# EAGLE design smart_tft (EAGLE 6.2)
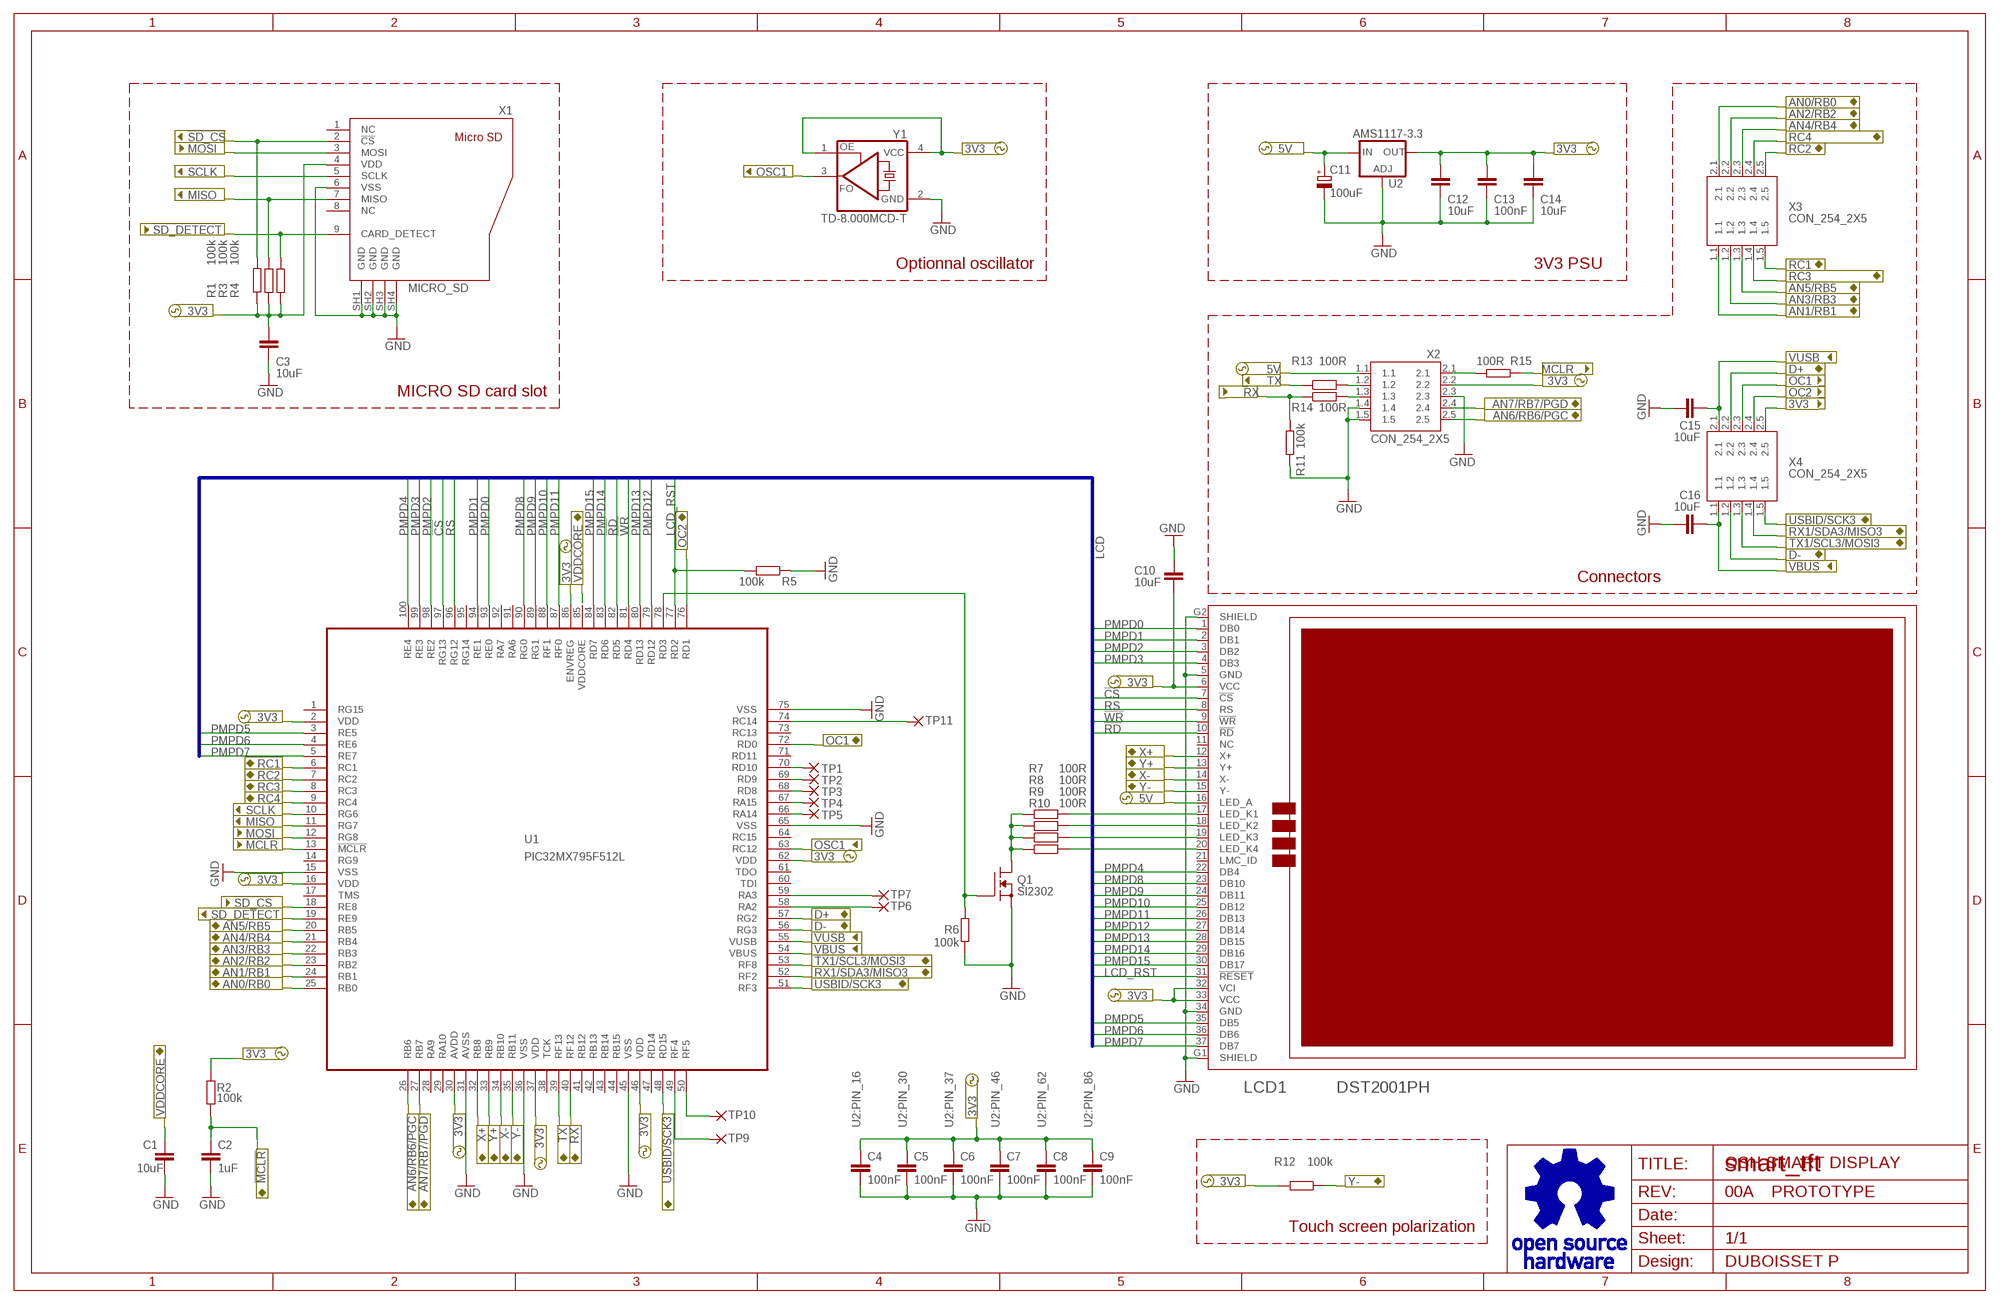
[diagram p0: schematic, sheet 1]

## Parts
C1  10uF  C-EUC0805  [C0805]
C2  1uF  C-EUC0603  [C0603]
C3  10uF  C-EUC0805  [C0805]
C4  100nF  C-EUC0603  [C0603]
C5  100nF  C-EUC0603  [C0603]
C6  100nF  C-EUC0603  [C0603]
C7  100nF  C-EUC0603  [C0603]
C8  100nF  C-EUC0603  [C0603]
C9  100nF  C-EUC0603  [C0603]
C10  10uF  C-EUC0805  [C0805]
C11  100uF  CPOL-EUSMCD  [SMC_D]
C12  10uF  C-EUC0805  [C0805]
C13  100nF  C-EUC0603  [C0603]
C14  10uF  C-EUC0805  [C0805]
C15  10uF  C-EUC0805  [C0805]
C16  10uF  C-EUC0805  [C0805]
LCD1  DST2001PH  [DST2001PH]
Q1  SI2302  [SOT23-BEC]
R1  100k  R-EU_R0603  [R0603]
R2  100k  R-EU_R0603  [R0603]
R3  100k  R-EU_R0603  [R0603]
R4  100k  R-EU_R0603  [R0603]
R5  100k  R-EU_R0603  [R0603]
R6  100k  R-EU_R0603  [R0603]
R7  100R  R-EU_R0603  [R0603]
R8  100R  R-EU_R0603  [R0603]
R9  100R  R-EU_R0603  [R0603]
R10  100R  R-EU_R0603  [R0603]
R11  100k  R-EU_R0603  [R0603]
R12  100k  R-EU_R0603  [R0603]
R13  100R  R-EU_R0603  [R0603]
R14  100R  R-EU_R0603  [R0603]
R15  100R  R-EU_R0603  [R0603]
TP1  1.27R  [1.27R]
TP2  1.27R  [1.27R]
TP3  1.27R  [1.27R]
TP4  1.27R  [1.27R]
TP5  1.27R  [1.27R]
TP6  1.27R  [1.27R]
TP7  1.27R  [1.27R]
TP9  1.27R  [1.27R]
TP10  1.27R  [1.27R]
TP11  1.27R  [1.27R]
U1  PIC32MX795F512L  PIC24FJ256GB110  [TQFP100-14X14]
U2  AMS1117-3.3  LD117AS33TR  [SOT223]
X1  MICRO_SD  [SD_MICRO]
X2  CON_254_2X5  [2X5_CMS]
X3  CON_254_2X5  [2X5_CMS]
X4  CON_254_2X5  [2X5_CMS]
Y1  TD-8.000MCD-T  ASF1  [ASF]

## Nets
3V3: C3.1 C4.1 C5.1 C6.1 C7.1 C8.1 C9.1 C10.2 C12.1 C13.1 C14.1 LCD1.6(VCC) LCD1.32(VCI) LCD1.33(VCC) R1.1 R2.2 R3.2 R4.2 R12.2 U1.2(VDD) U1.16(VDD) U1.30(AVDD) U1.37(VDD) U1.46(VDD) U1.62(VDD) U1.86(ENVREG) U2.4(OUT) X1.4(VDD) X2.2.2 X4.2.5 Y1.1(OE) Y1.4(VCC)
5V: C11.+ LCD1.16(LED_A) U2.3(IN) X2.1.1
!CS: LCD1.7(!CS) U1.97(RG13)
!MCLR: C2.1 R2.1 R15.1 U1.13(!MCLR)
!RD: LCD1.10(!RD) U1.82(RD5)
!SD_CS: R1.2 U1.18(RE8) X1.2(!CS)
!SD_DETECT: R4.1 U1.19(RE9) X1.9(CARD_DETECT)
!WR: LCD1.9(!WR) U1.81(RD4)
AN0/RB0: U1.25(RB0) X3.2.1
AN1/RB1: U1.24(RB1) X3.1.1
AN2/RB2: U1.23(RB2) X3.2.2
AN3/RB3: U1.22(RB3) X3.1.2
AN4/RB4: U1.21(RB4) X3.2.3
AN5/RB5: U1.20(RB5) X3.1.3
AN6/RB6/PGC: U1.26(RB6) X2.2.5
AN7/RB7/PGD: U1.27(RB7) X2.2.4
D+: U1.57(RG2) X4.2.2
D-: U1.56(RG3) X4.1.2
GND: C1.1 C2.2 C3.2 C4.2 C5.2 C6.2 C7.2 C8.2 C9.2 C10.1 C11.- C12.2 C13.2 C14.2 C15.2 C16.2 LCD1.5(GND) LCD1.34(GND) LCD1.G1(SHIELD) LCD1.G2(SHIELD) Q1.E(S) R5.1 R6.1 R11.1 U1.15(VSS) U1.31(AVSS) U1.36(VSS) U1.45(VSS) U1.65(VSS) U1.75(VSS) U2.1(ADJ) X1.6(VSS) X1.SH1(GND) X1.SH2(GND) X1.SH3(GND) X1.SH4(GND) X2.1.4 X2.1.5 X2.2.3 Y1.2(GND)
LCD_RST: LCD1.31(!RESET) R5.2 U1.77(RD2)
MISO: R3.1 U1.11(RG7) X1.7(MISO)
MOSI: U1.12(RG8) X1.3(MOSI)
N$1: TP6.P$1(P) U1.58(RA2)
N$2: Q1.C(D) R7.1 R8.1 R9.1 R10.1
N$3: Q1.B(G) R6.2 U1.78(RD3)
N$4: R13.2 X2.1.2
N$5: R14.2 X2.1.3
N$6: TP7.P$1(P) U1.59(RA3)
N$7: TP5.P$1(P) U1.66(RA14)
N$8: TP4.P$1(P) U1.67(RA15)
N$9: LCD1.20(LED_K4) R10.2
N$10: LCD1.19(LED_K3) R9.2
N$11: LCD1.18(LED_K2) R8.2
N$12: LCD1.17(LED_K1) R7.2
N$13: TP3.P$1(P) U1.68(RD8)
N$14: TP2.P$1(P) U1.69(RD9)
N$15: TP1.P$1(P) U1.70(RD10)
N$17: TP9.P$1(P) U1.49(RF4)
N$18: TP10.P$1(P) U1.50(RF5)
N$19: TP11.P$1(P) U1.74(RC14)
N$65: R15.2 X2.2.1
OC1: U1.72(RD0) X4.2.3
OC2: U1.76(RD1) X4.2.4
OSC1: U1.63(RC12) Y1.3(FO)
PMPD0: LCD1.1(DB0) U1.93(RE0)
PMPD1: LCD1.2(DB1) U1.94(RE1)
PMPD2: LCD1.3(DB2) U1.98(RE2)
PMPD3: LCD1.4(DB3) U1.99(RE3)
PMPD4: LCD1.22(DB4) U1.100(RE4)
PMPD5: LCD1.35(DB5) U1.3(RE5)
PMPD6: LCD1.36(DB6) U1.4(RE6)
PMPD7: LCD1.37(DB7) U1.5(RE7)
PMPD8: LCD1.23(DB10) U1.90(RG0)
PMPD9: LCD1.24(DB11) U1.89(RG1)
PMPD10: LCD1.25(DB12) U1.88(RF1)
PMPD11: LCD1.26(DB13) U1.87(RF0)
PMPD12: LCD1.27(DB14) U1.79(RD12)
PMPD13: LCD1.28(DB15) U1.80(RD13)
PMPD14: LCD1.29(DB16) U1.83(RD6)
PMPD15: LCD1.30(DB17) U1.84(RD7)
RC1: U1.6(RC1) X3.1.5
RC2: U1.7(RC2) X3.2.5
RC3: U1.8(RC3) X3.1.4
RC4: U1.9(RC4) X3.2.4
RS: LCD1.8(RS) U1.96(RG12)
RX: R11.2 R14.1 U1.40(RF12)
RX1/SDA3/MISO3: U1.52(RF2) X4.1.4
SCLK: U1.10(RG6) X1.5(SCLK)
TX: R13.1 U1.39(RF13)
TX1/SCL3/MOSI3: U1.53(RF8) X4.1.3
USBID/SCK3: U1.48(RD15) U1.51(RF3) X4.1.5
VBUS: C16.1 U1.54(VBUS) X4.1.1
VDDCORE: C1.2 U1.85(VDDCORE)
VUSB: C15.1 U1.55(VUSB) X4.2.1
X+: LCD1.12(X+) U1.32(RB8)
X-: LCD1.14(X-) U1.34(RB10)
Y+: LCD1.13(Y+) U1.33(RB9)
Y-: LCD1.15(Y-) R12.1 U1.35(RB11)
Unconnected: LCD1.11(NC) LCD1.21(LMC_ID) U1.1(RG15) U1.14(RG9) U1.17(TMS) U1.28(RA9) U1.29(RA10) U1.38(TCK) U1.41(RB12) U1.42(RB13) U1.43(RB14) U1.44(RB15) U1.47(RD14) U1.60(TDI) U1.61(TDO) U1.64(RC15) U1.71(RD11) U1.73(RC13) U1.91(RA6) U1.92(RA7) U1.95(RG14) X1.1(NC) X1.8(NC)

## Buses
LCD

## Notes on the sheet
- Optionnal oscillator | 3V3 PSU
- MICRO SD card slot
- Connectors
- U2:PIN_16 | U2:PIN_30 | U2:PIN_37 | U2:PIN_46 | U2:PIN_62 | U2:PIN_86
- OSH SMART DISPLAY
- 00A | PROTOTYPE
- Touch screen polarization

## Library data of the parts
C1-C10 C12-C16 = rcl:C-EU: CAPACITOR, European symbol
C11 = rcl:CPOL-EU: POLARIZED CAPACITOR, European symbol
LCD1 = tft:DST2001PH
Q1 = transistor:SI2302
R1-R15 = rcl:R-EU_: RESISTOR, European symbol
TP1-TP7 TP9-TP11 = wirepad:1.27R
U1 = microchip:PIC24FJ256GB110: PIC24FJ256GB110 edit this description Auto generated by make-symbol-device-package-bsdl.ulp Rev. 25 Source: PIC24FJ256GB110.bsd; MPN: PIC24FJ256GB110-I/PF; OC_FARNELL: 1576870; OC_NEWARK: 54M5133
U2 = v-reg:LD117A?*: Low drop fixed and adjustable positive voltage regulators 1 A Source: http://www.st.com/stonline/products/literature/ds/7194/ld1117axx.pdf
X1 = sd-card:MICRO_SD
X2-X4 = con254:CON_254_2X5
Y1 = crystal:ASF*: CRYSTAL CLOCK OSCILLATORS 5.0 Vdc or 3.3 Vdc - LOW PROFILE ULTRA MINIATURE CERAMIC SURFACE MOUNT Source: http://www.abracon.com/Oscillators/asf1-L-L1.pdf; OC_FARNELL: unknown; OC_NEWARK: unknown

## Board
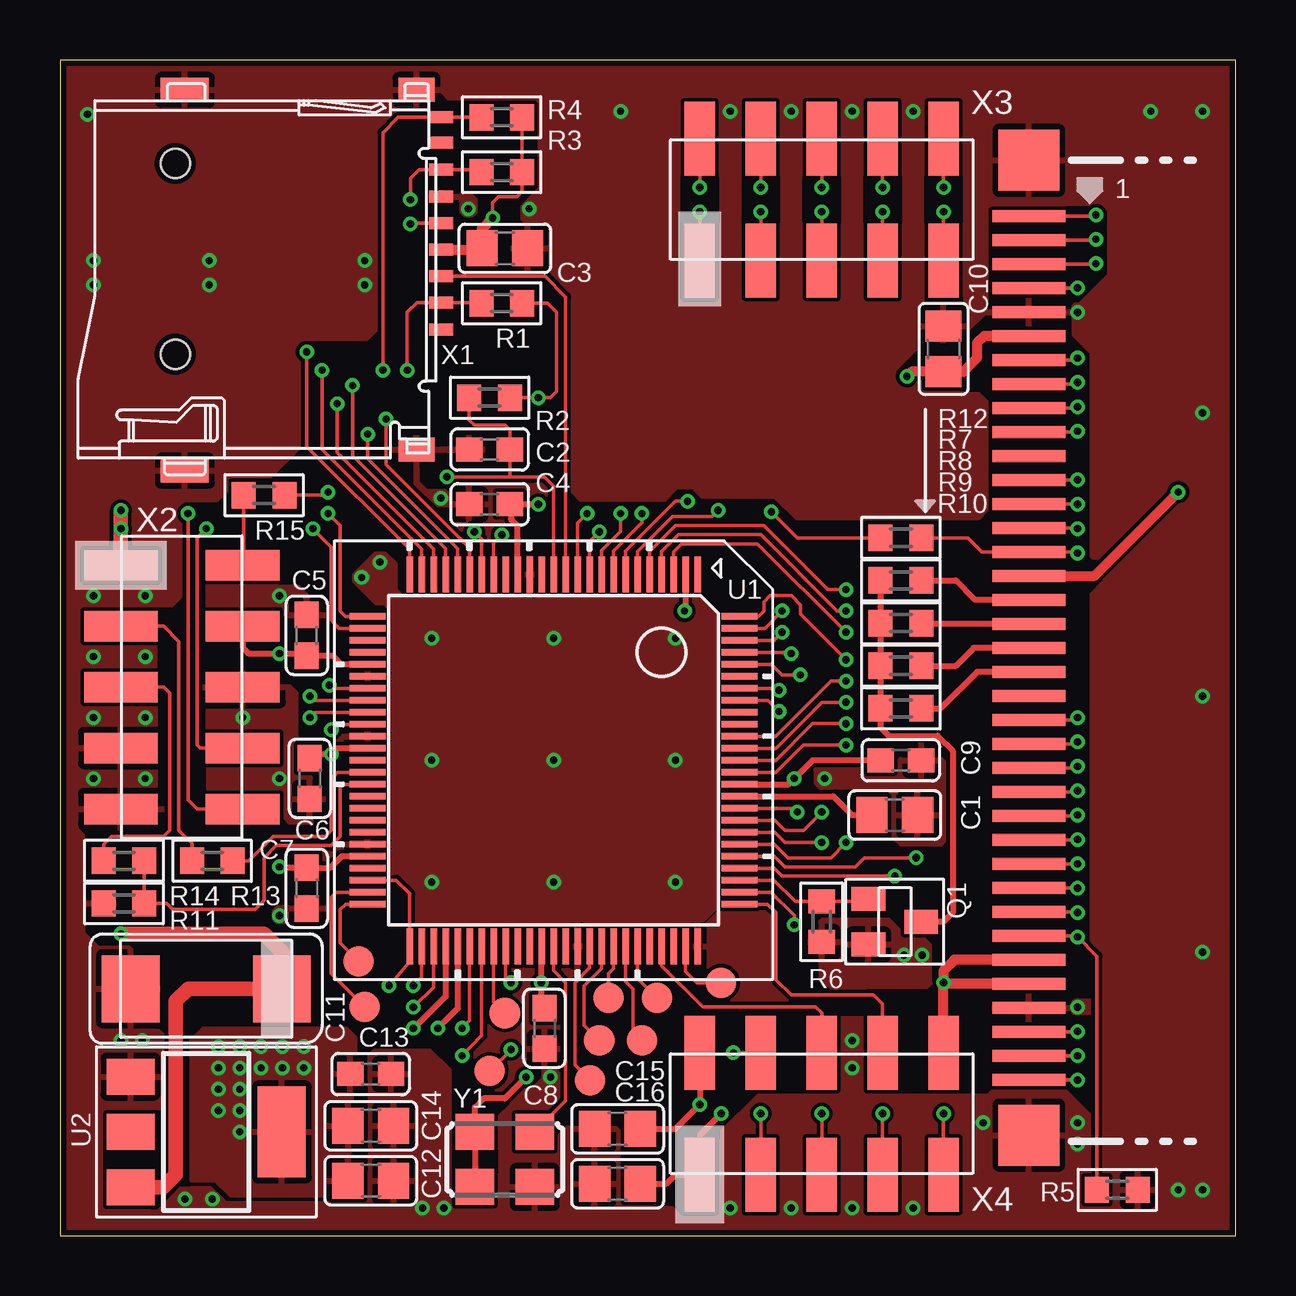
[diagram p1: board, top side]
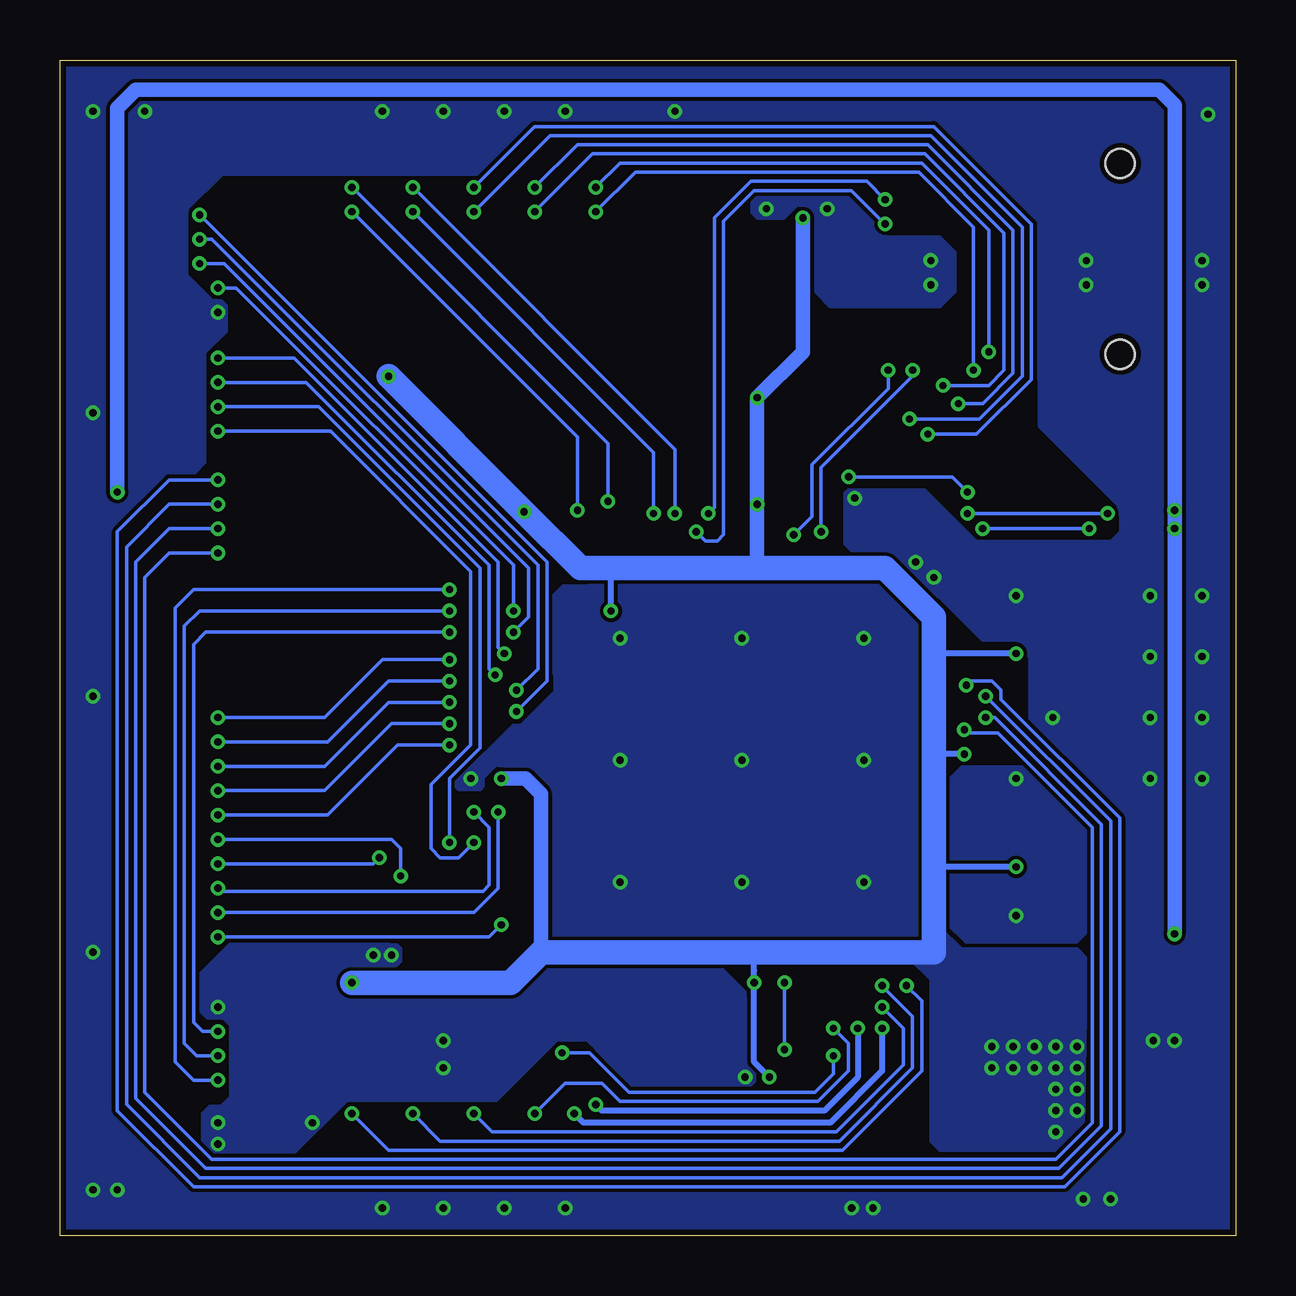
[diagram p2: board, bottom side, seen from below]

Size 49 x 49 mm. Coordinates in mm from the lower left corner, seen from the top.
Outline: 0,0 49,0 49,49 0,49 0,0
Copper layers (1*16): Top 0.035mm / dielectric 1.5mm / Bottom 0.035mm
Design rules: minimum track width 6mil, minimum drill 12mil, track to track 6mil, track to pad 6mil, pad to pad 6mil, via to via 6mil, smd to smd 0mil, copper to edge 10mil, drill to drill 10mil, minimum pad ring 10mil, minimum via ring 6mil, stop-mask expansion 2mil, vias tented up to drill 100mil, thermal gap 10mil
tRestrict: 257 lines
bRestrict: 74 lines

### Footprints (pad centres in the part's own frame; a part is rotated, then mirrored left to right if it is on the bottom)
C0805 = smd 1.3 x 1.5: 1 -0.95,0; 2 0.95,0
C0603 = smd 1.1 x 1: 1 -0.85,0; 2 0.85,0
SMC_D = smd 2.4 x 2.8: + -3.15,0; - 3.15,0
DST2001PH = smd 3.048 x 0.5: 1 0,18; 2 0,17; 3 0,16; 4 0,15; 5 0,14; 6 0,13; 7 0,12; 8 0,11; 9 0,10; 10 0,9; 11 0,8; 12 0,7; 13 0,6; 14 0,5; 15 0,4; 16 0,3; 17 0,2; 18 0,1; 19 0,0; 20 0,-1; 21 0,-2; 22 0,-3; 23 0,-4; 24 0,-5; 25 0,-6; 26 0,-7; 27 0,-8; 28 0,-9; 29 0,-10; 30 0,-11; 31 0,-12; 32 0,-13; 33 0,-14; 34 0,-15; 35 0,-16; 36 0,-17; 37 0,-18 | smd 2.54 x 2.54: G1 0,20.32; G2 0,-20.32
SOT23-BEC = smd 1 x 1.4: B -0.95,-1.1; C 0,1.1; E 0.95,-1.1
R0603 = smd 1 x 1.1: 1 -0.85,0; 2 0.85,0
1.27R = smd 1.27 x 1.27: P$1 0,0
TQFP100-14X14 = smd 0.27 x 1.5: 1 -6,-7.75; 2 -5.5,-7.75; 3 -5,-7.75; 4 -4.5,-7.75; 5 -4,-7.75; 6 -3.5,-7.75; 7 -3,-7.75; 8 -2.5,-7.75; 9 -2,-7.75; 10 -1.5,-7.75; 11 -1,-7.75; 12 -0.5,-7.75; 13 0,-7.75; 14 0.5,-7.75; 15 1,-7.75; 16 1.5,-7.75; 17 2,-7.75; 18 2.5,-7.75; 19 3,-7.75; 20 3.5,-7.75; 21 4,-7.75; 22 4.5,-7.75; 23 5,-7.75; 24 5.5,-7.75; 25 6,-7.75; 51 6,7.75; 52 5.5,7.75; 53 5,7.75; 54 4.5,7.75; 55 4,7.75; 56 3.5,7.75; 57 3,7.75; 58 2.5,7.75; 59 2,7.75; 60 1.5,7.75; 61 1,7.75; 62 0.5,7.75; 63 0,7.75; 64 -0.5,7.75; 65 -1,7.75; 66 -1.5,7.75; 67 -2,7.75; 68 -2.5,7.75; 69 -3,7.75; 70 -3.5,7.75; 71 -4,7.75; 72 -4.5,7.75; 73 -5,7.75; 74 -5.5,7.75; 75 -6,7.75 | smd 1.5 x 0.27: 26 7.75,-6; 27 7.75,-5.5; 28 7.75,-5; 29 7.75,-4.5; 30 7.75,-4; 31 7.75,-3.5; 32 7.75,-3; 33 7.75,-2.5; 34 7.75,-2; 35 7.75,-1.5; 36 7.75,-1; 37 7.75,-0.5; 38 7.75,0; 39 7.75,0.5; 40 7.75,1; 41 7.75,1.5; 42 7.75,2; 43 7.75,2.5; 44 7.75,3; 45 7.75,3.5; 46 7.75,4; 47 7.75,4.5; 48 7.75,5; 49 7.75,5.5; 50 7.75,6; 76 -7.75,6; 77 -7.75,5.5; 78 -7.75,5; 79 -7.75,4.5; 80 -7.75,4; 81 -7.75,3.5; 82 -7.75,3; 83 -7.75,2.5; 84 -7.75,2; 85 -7.75,1.5; 86 -7.75,1; 87 -7.75,0.5; 88 -7.75,0; 89 -7.75,-0.5; 90 -7.75,-1; 91 -7.75,-1.5; 92 -7.75,-2; 93 -7.75,-2.5; 94 -7.75,-3; 95 -7.75,-3.5; 96 -7.75,-4; 97 -7.75,-4.5; 98 -7.75,-5; 99 -7.75,-5.5; 100 -7.75,-6
SOT223 = smd 1.5 x 2: 1 -2.3,-3.15; 2 0,-3.15; 3 2.3,-3.15 | smd 3.8 x 2: 4 0,3.15
SD_MICRO = smd 0.5 x 1: 1 -2.108,-6.985; 2 -0.991,-6.985; 3 0.102,-6.985; 4 1.219,-6.985; 5 2.311,-6.985; 6 3.429,-6.985; 7 4.547,-6.985; 8 5.664,-6.985; 9 6.731,-6.985 | smd 1 x 2: SH1 7.874,3.683; SH2 -8.001,3.683 | smd 1 x 1.5: SH3 7.874,-5.969; SH4 -7.112,-5.969 | hole 1.2: 4.81,4.08; -3.148,4.08
2X5_CMS = smd 3.08 x 1.27: 1.1 -2.54,5.08; 1.2 -2.54,2.54; 1.3 -2.54,0; 1.4 -2.54,-2.54; 1.5 -2.54,-5.08; 2.1 2.54,5.08; 2.2 2.54,2.54; 2.3 2.54,0; 2.4 2.54,-2.54; 2.5 2.54,-5.08
ASF = smd 1.6 x 1.5: 1 -1.25,-1.15; 2 1.25,-1.15; 3 1.25,1.15; 4 -1.25,1.15

### Placement (x,y rotation side)
C1  34.8,17.53 180 top
C2  17.91,32.77 180 top
C3  18.54,41.15 0 top
C4  17.91,30.48 180 top
C5  10.29,25.02 90 top
C6  10.41,19.05 270 top
C7  10.29,14.48 270 top
C8  20.19,8.64 270 top
C9  35.05,19.81 0 top
C10  36.83,36.96 270 top
C11  6.1,10.29 180 top
C12  12.95,2.29 0 top
C13  12.95,6.73 0 top
C14  12.95,4.57 0 top
C15  23.24,4.45 180 top
C16  23.24,2.16 180 top
LCD1  40.39,24.5 0 top
Q1  34.8,13.08 270 top
R1  18.41,38.86 180 top
R2  17.91,34.92 0 top
R3  18.41,44.32 0 top
R4  18.41,46.61 0 top
R5  44.07,1.91 180 top
R6  31.75,13.08 90 top
R7  35.05,27.3 0 top
R8  35.05,25.53 0 top
R9  35.05,23.75 0 top
R10  35.05,21.97 0 top
R11  2.67,13.84 0 top
R12  35.05,29.08 180 top
R13  6.35,15.62 180 top
R14  2.67,15.62 180 top
R15  8.51,30.86 180 top
TP1  24.89,9.91 0 top
TP2  24.26,8.13 0 top
TP3  22.86,9.91 0 top
TP4  22.48,8.13 0 top
TP5  22.1,6.48 0 top
TP6  18.54,9.27 0 top
TP7  17.91,6.86 0 top
TP9  12.7,9.53 0 top
TP10  12.45,11.43 0 top
TP11  27.56,10.54 0 top
U1  20.57,19.81 180 top
U2  6.1,4.32 270 top
X1  8.89,39.88 90 top
X2  5.08,22.86 0 top
X3  31.75,43.18 90 top
X4  31.75,5.08 90 top
Y1  18.54,3.17 0 top

### Tracks (layer width: path | path; a pad name or v marks a point on that pad's centre or on a via)
3V3  (via drill 0.3)
  Top 0.152: R12.2 30.73,29.08 v29.65,30.16 | R2.2 v19.94,34.92 20.45,34.92 20.7,35.18 20.7,38.48 20.32,38.86 R1.1 | R4.2 R3.2 19.27,43.52 19.05,43.31 18.29,43.31 18.03,43.05 v18.03,42.42
  Top 0.254: C8.1 20.07,9.49 v20.07,10.54 U1.62 | C9.1 31.37,19.81 v30.61,19.05 30.37,18.81 U1.86 | X2.2.2 7.62,24.51 7.87,24.26 v9.14,24.26 10.2,24.26 arc-90 C5.1 11.39,24.17 11.75,23.81 U1.30 | v9.14,15.37 9.18,15.33 C7.1 11.26,15.33 11.75,15.81 U1.46 | Y1.1 Y1.4 17.29,5.35 17.65,5.71 18.54,5.71 v19.43,6.6 | C6.1 10.58,20.07 v11.3,20.07 11.55,20.31 U1.37 | U1.16 19.07,29.57 18.8,29.84 18.8,30.44 C4.1 v19.94,30.48 | U1.2 26.07,26.07 v26.04,26.04
  Top 0.406: LCD1.33 36.87,10.5 v36.83,10.54 | LCD1.32 37.28,11.5 36.83,11.05 v36.83,10.54 | X4.2.5 v36.83,10.54 | X1.4 17.54,41.1 C3.1 17.59,41.98 v18.03,42.42 | LCD1.6 38.52,37.5 38.23,37.21 38.23,36.58 37.66,36.01 C10.2 35.5,36.01 v35.31,35.81
  Bottom 0.254: 19.94,27.94 19.56,27.81 | v9.14,24.26 12.57,24.26 | v11.3,20.07 12.57,20.07 | v9.14,15.37 12.57,15.37 | v19.43,6.6 20.07,7.24 v20.07,10.54 20.07,11.05 20.07,11.81 | v26.04,26.04 26.04,27.56 25.78,27.81
  Bottom 0.61: v30.61,19.05 29.59,19.05 28.96,18.41 28.96,11.81 | 19.94,27.94 v19.94,30.48 v19.94,34.92 18.03,36.83 v18.03,42.42
  Bottom 1.016: v35.31,35.81 v29.65,30.16 27.3,27.81 25.78,27.81 19.56,27.81 14.61,27.81 12.57,25.78 12.57,24.26 12.57,20.07 12.57,15.37 12.57,11.81 20.07,11.81 28.96,11.81 30.23,10.54 v36.83,10.54
  other vias: 7.49,4.32 7.49,5.21 7.49,6.1 7.49,6.99 8.38,6.99 9.27,6.99 10.16,6.99 10.16,7.87 9.27,7.87 8.38,7.87 7.49,7.87 6.6,5.21 6.6,6.1 6.6,6.99 6.6,7.87
  pour Top: 5.97,8.64 11.94,8.64 12.32,8.26 12.32,5.84 12.57,5.59 12.57,1.65 7.11,1.65 6.48,2.29 5.46,2.29 5.46,8.13
  pour Bottom: 6.6,11.94 11.43,11.94 12.32,12.83 13.59,11.56 12.7,10.67 12.7,3.94 12.32,3.56 7.24,3.56 6.35,4.45 6.22,11.56
5V  (via drill 0.3)
  Top 0.406: 9.27,10.44 C11.+ | LCD1.16 43.12,27.5 v46.61,30.99
  Top 0.61: U2.3 4.3,2.02 4.83,2.54 4.83,9.78 5.33,10.29 C11.+ | v2.54,12.57 8.51,12.57 9.27,11.81 9.27,10.44 | X2.1.1 v2.54,29.46 v2.54,30.23
  Bottom 0.61: v2.54,12.57 v2.54,29.46 v2.54,30.23 2.54,47.12 3.17,47.75 45.85,47.75 46.61,46.99 v46.61,30.99
!CS  (via drill 0.3)
  Top 0.152: U1.97 30.43,24.31 v30.48,24.26 | LCD1.7 42.34,36.5 v42.42,36.58
  Bottom 0.152: v30.48,24.26 30.73,24.51 30.73,28.07 39.24,36.58 v42.42,36.58
!MCLR  (via drill 0.3)
  Top 0.152: R15.1 11.05,30.86 v11.18,30.99 | v16.13,31.62 18.8,31.62 | 18.8,31.62 20.19,31.62 20.57,31.24 U1.13 | 18.8,31.62 18.76,31.66 C2.1 18.76,33.57 18.54,33.78 17.27,33.78 17.06,34 R2.1
  Bottom 0.152: v11.18,30.99 11.81,31.62 v16.13,31.62
!RD  (via drill 0.3)
  Top 0.152: U1.82 29.8,16.81 30.23,16.38 v31.75,16.38 | LCD1.10 42.39,33.5 v42.42,33.53
  Bottom 0.152: v31.75,16.38 32.38,15.75 33.15,15.75 33.53,16.13 33.53,18.8 31.88,20.45 31.88,27.69 37.72,33.53 v42.42,33.53
!SD_CS  (via drill 0.3)
  Top 0.152: U1.18 18.07,28.87 v18.41,29.21 | v14.48,36.07 14.48,38.48 14.88,38.89 X1.2 17.54,38.89 R1.2
  Bottom 0.152: v14.48,36.07 14.48,35.31 17.65,32.13 17.65,29.97 v18.41,29.21
!SD_DETECT  (via drill 0.3)
  Top 0.152: U1.19 17.57,29.04 v17.27,29.34 | v13.46,36.07 13.46,45.97 14.1,46.61 X1.9 R4.1
  Bottom 0.152: v17.27,29.34 17.27,32 13.46,35.81 v13.46,36.07
!WR  (via drill 0.3)
  Top 0.152: U1.81 29.79,16.31 30.35,15.75 32.13,15.75 v32.77,16.38 | LCD1.9 42.37,34.5 v42.42,34.54
  Bottom 0.152: v32.77,16.38 32.77,19.05 31.5,20.32 31.5,27.81 38.23,34.54 v42.42,34.54
AN0/RB0  (via drill 0.3)
  Top 0.152: U1.25 14.57,28.61 10.29,32.89 v10.29,36.83 | X3.2.1 v26.67,43.69
  Bottom 0.152: v26.67,43.69 25.65,44.7 13.08,44.7 10.29,41.91 v10.29,36.83
AN1/RB1  (via drill 0.3)
  Top 0.152: U1.24 15.07,28.61 10.92,32.77 v10.92,36.07 | X3.1.1 v26.67,42.67
  Bottom 0.152: v26.67,42.67 25.02,44.32 13.21,44.32 10.92,42.04 v10.92,36.07
AN2/RB2  (via drill 0.3)
  Top 0.152: U1.23 15.57,28.62 11.56,32.64 v11.56,34.67 | X3.2.2 v29.21,43.69
  Bottom 0.152: v29.21,43.69 27.43,45.47 12.83,45.47 9.27,41.91 9.27,35.94 10.54,34.67 v11.56,34.67
AN3/RB3  (via drill 0.3)
  Top 0.152: U1.22 16.07,28.63 12.19,32.51 v12.19,35.43 | X3.1.2 v29.21,42.67
  Bottom 0.152: v29.21,42.67 26.8,45.09 12.95,45.09 9.65,41.78 9.65,36.07 10.29,35.43 v12.19,35.43
AN4/RB4  (via drill 0.3)
  Top 0.152: U1.21 16.57,28.64 12.83,32.38 v12.83,33.4 | X3.2.3 v31.75,43.69
  Bottom 0.152: v31.75,43.69 29.21,46.23 12.57,46.23 8.51,42.16 8.51,35.69 10.79,33.4 v12.83,33.4
AN5/RB5  (via drill 0.3)
  Top 0.152: U1.20 17.07,28.65 13.59,32.13 v13.59,34.04 | X3.1.3 v31.75,42.67
  Bottom 0.152: v31.75,42.67 28.57,45.85 12.7,45.85 8.89,42.04 8.89,35.81 10.67,34.04 v13.59,34.04
AN6/RB6/PGC  (via drill 0.3)
  Top 0.152: U1.26 11.91,25.81 11.68,26.04 11.68,29.59 v11.18,30.1 | X2.2.5 5.71,17.78 5.33,18.16 v5.33,30.1
  Bottom 0.152: v5.33,30.1 v11.18,30.1
AN7/RB7/PGD  (via drill 0.3)
  Top 0.152: U1.27 11.64,25.31 11.3,25.65 11.3,28.7 v10.54,29.46 | X2.2.4 5.84,20.32 5.71,20.45 5.71,29.08 v6.1,29.46
  Bottom 0.152: v6.1,29.46 v10.54,29.46
D+  (via drill 0.3)
  Top 0.152: U1.57 17.57,8.33 v16.76,7.49 | v28.07,7.62 X4.2.2
  Bottom 0.152: v16.76,7.49 16.76,6.73 17.53,5.97 25.27,5.97 26.92,7.62 v28.07,7.62
D-  (via drill 0.3)
  Top 0.152: U1.56 17.07,8.96 v16.76,8.64 | v29.21,5.08 X4.1.2
  Bottom 0.152: v16.76,8.64 16.13,8 16.13,6.86 17.4,5.59 25.65,5.59 26.42,6.35 27.94,6.35 v29.21,5.08
GND  (via drill 0.3)
  Top 0.406: 40.37,38.48 LCD1.5
  other vias: 3.56,19.05 1.4,19.05 15.49,14.73 20.57,14.73 25.65,14.73 15.49,19.81 20.57,19.81 25.65,19.81 25.65,24.89 20.57,24.89 15.49,24.89 15.11,1.14 35.18,11.68 15.88,30.73 42.42,9.53 42.42,38.48 9.14,26.67 2.54,8.13 46.61,1.91 47.62,1.91 47.62,46.86 45.47,46.86 1.4,21.59 3.56,21.59 42.42,4.7 17.02,42.8 9.14,19.05 3.43,8.13 12.7,40.64 12.7,39.62 19.56,42.8 12.57,27.43 13.34,28.07 6.22,40.64 6.22,39.62 5.21,1.52 6.35,1.52 9.14,13.34 31.88,19.05 20.45,6.6 38.48,4.7 16,1.14 35.94,11.68 42.42,3.81 7.62,21.59 33.02,1.14 33.02,6.99 33.02,8.13 23.37,46.86 33.02,46.86 1.14,46.74 47.62,34.29 47.62,22.48 47.62,11.81 1.4,24.13 3.56,24.13 3.56,26.67 1.4,26.67 1.4,40.64 1.4,39.62 27.94,1.14 30.48,1.14 35.56,1.14 27.94,46.86 30.48,46.86 35.56,46.86
  pour Top (rank 6): -0.89,50.16 50.29,50.16 50.29,-1.27 -0.89,-1.27
  pour Bottom (rank 6): -2.16,51.05 51.31,51.05 51.31,-2.16 -2.16,-2.16
LCD_RST  (via drill 0.3)
  Top 0.152: U1.77 29.63,14.31 30.61,13.34 v30.61,12.95 | LCD1.31 42.36,12.5 v42.42,12.45 43.22,11.64 R5.2
  Bottom 0.152: v42.42,12.45 31.11,12.45 v30.61,12.95
MISO  (via drill 0.3)
  Top 0.152: v14.61,43.18 14.61,44.07 14.96,44.42 X1.7 17.46,44.42 R3.1 | U1.11 21.57,29.7 v21.97,30.1
  Bottom 0.152: v14.61,43.18 15.37,43.94 20.19,43.94 21.72,42.42 21.72,30.35 v21.97,30.1
MOSI
  Top 0.152: X1.3 20.22,39.98 21.07,39.12 U1.12
N$1
  Top 0.152: U1.58 18.07,9.74 TP6.P$1
N$2
  Top 0.254: R7.1 R8.1 R9.1 R10.1 34.2,21.17 34.54,20.83 36.58,20.83 37.21,20.19 37.21,13.46 36.83,13.08 Q1.C
N$3
  Top 0.152: U1.78 29.77,14.81 30.65,13.93 R6.2 33.7,13.93 Q1.B
N$4
  Top 0.152: X2.1.2 4.32,25.4 4.95,24.77 4.95,16.89 5.5,16.34 R13.2
N$5
  Top 0.152: X2.1.3 4.32,22.86 4.57,22.61 4.57,16.89 4.32,16.64 2.16,16.64 1.82,16.3 R14.2
N$6  (via drill 0.3)
  Top 0.152: U1.59 18.57,10.76 v18.8,10.54 | v18.8,7.75 TP7.P$1
  Bottom 0.152: v18.8,10.54 v18.8,7.75
N$7
  Top 0.152: TP5.P$1 21.46,7.11 21.46,10.54 22.07,11.15 U1.66
N$8
  Top 0.152: U1.67 22.57,11.14 21.84,10.41 21.84,8.76 TP4.P$1
N$9
  Top 0.254: LCD1.20 38.23,23.5 36.7,21.97 R10.2
N$10
  Top 0.254: LCD1.19 38.09,24.5 37.34,23.75 R9.2
N$11
  Top 0.254: LCD1.18 36.06,25.5 R8.2
N$12
  Top 0.254: LCD1.17 38.14,26.5 37.34,27.3 R7.2
N$13
  Top 0.152: U1.68 23.07,11.14 22.86,10.92 TP3.P$1
N$14
  Top 0.152: U1.69 23.57,10.59 23.88,10.29 23.88,8.51 TP2.P$1
N$15
  Top 0.152: U1.70 24.07,10.72 TP1.P$1
N$17
  Top 0.152: U1.49 11.52,14.31 11.3,14.1 11.3,10.92 TP9.P$1
N$18
  Top 0.152: U1.50 11.91,13.81 11.68,13.59 11.68,12.19 TP10.P$1
N$19
  Top 0.152: U1.74 26.07,11.01 26.54,10.54 TP11.P$1
N$65
  Top 0.152: R15.2 7.66,27.98 X2.2.1
OC1
  Top 0.152: U1.72 25.07,11.25 26.8,9.53 31.5,9.53 31.75,9.27 X4.2.3
OC2
  Top 0.152: U1.76 29.5,13.81 29.84,13.46 29.85,10.66 30.48,10.03 33.91,10.03 34.29,9.65 X4.2.4
OSC1
  Top 0.152: U1.63 20.57,11.05 21.08,10.54 21.08,5.62 Y1.3
PMPD0  (via drill 0.3)
  Top 0.152: U1.93 29.5,22.31 v29.97,21.84 | LCD1.1 43.13,42.5 v43.18,42.55
  Bottom 0.152: v29.97,21.84 28.7,23.11 28.7,28.07 v43.18,42.55
PMPD1  (via drill 0.3)
  Top 0.152: U1.94 29.89,22.81 v29.97,22.73 | LCD1.2 43.15,41.5 v43.18,41.53
  Bottom 0.152: v29.97,22.73 29.08,23.62 29.08,27.94 42.67,41.53 v43.18,41.53
PMPD2  (via drill 0.3)
  Top 0.152: U1.98 29.77,24.81 v30.1,25.15 | LCD1.3 43.17,40.5 v43.18,40.51
  Bottom 0.152: v30.1,25.15 29.46,25.78 29.46,27.81 42.16,40.51 v43.18,40.51
PMPD3  (via drill 0.3)
  Top 0.152: U1.99 29.38,25.31 v30.1,26.04 | LCD1.4 v42.41,39.5 v42.42,39.5
  Bottom 0.152: v30.1,26.04 30.1,27.94 41.66,39.5 v42.42,39.5
PMPD4  (via drill 0.3)
  Top 0.152: v32.77,24 30.86,25.91 30.86,26.29 30.48,26.67 29.59,26.67 29.34,26.42 29.34,26.04 29.11,25.81 U1.100 | LCD1.22 42.33,21.5 v42.42,21.59
  Bottom 0.152: v42.42,21.59 37.97,21.59 35.56,24 v32.77,24
PMPD5  (via drill 0.3)
  Top 0.152: U1.3 25.57,28.5 25.91,28.83 29.08,28.83 v32.77,25.15 | LCD1.35 42.41,8.5 v42.42,8.51
  Bottom 0.152: v32.77,25.15 42.93,25.15 43.43,24.64 43.43,8.89 43.05,8.51 v42.42,8.51
PMPD6  (via drill 0.3)
  Top 0.152: U1.4 25.07,28.5 25.78,29.21 29.21,29.21 32.38,26.04 v32.77,26.04 | LCD1.36 v42.41,7.5 v42.42,7.49
  Bottom 0.152: v32.77,26.04 43.18,26.04 43.81,25.4 43.81,8 43.31,7.49 v42.42,7.49
PMPD7  (via drill 0.3)
  Top 0.152: U1.5 24.57,28.51 25.65,29.59 29.34,29.59 32,26.92 v32.77,26.92 | LCD1.37 42.4,6.5 v42.42,6.48
  Bottom 0.152: v32.77,26.92 43.43,26.92 44.2,26.16 44.2,7.24 43.43,6.48 v42.42,6.48
PMPD8  (via drill 0.3)
  Top 0.152: U1.90 29.83,20.81 32.13,23.11 v32.77,23.11 | LCD1.23 42.34,20.5 v42.42,20.57
  Bottom 0.152: v42.42,20.57 37.85,20.57 35.31,23.11 v32.77,23.11
PMPD9  (via drill 0.3)
  Top 0.152: U1.89 29.84,20.31 31.75,22.23 v32.77,22.23 | LCD1.24 42.36,19.5 v42.42,19.56
  Bottom 0.152: v42.42,19.56 37.97,19.56 35.31,22.23 v32.77,22.23
PMPD10  (via drill 0.3)
  Top 0.152: U1.88 29.84,19.81 31.37,21.34 v32.77,21.34 | LCD1.25 42.38,18.5 v42.42,18.54
  Bottom 0.152: v42.42,18.54 37.97,18.54 35.18,21.34 v32.77,21.34
PMPD11  (via drill 0.3)
  Top 0.152: U1.87 29.85,19.31 30.99,20.45 v32.77,20.45 | LCD1.26 42.39,17.5 v42.42,17.53
  Bottom 0.152: v42.42,17.53 37.85,17.53 34.92,20.45 v32.77,20.45
PMPD12  (via drill 0.3)
  Top 0.152: U1.79 29.77,15.31 30.1,14.99 v34.8,14.99 | LCD1.27 42.41,16.5 v42.42,16.51
  Bottom 0.152: v42.42,16.51 35.18,16.51 34.8,16.13 v34.8,14.99
PMPD13  (via drill 0.3)
  Top 0.152: U1.80 29.78,15.81 30.23,15.37 33.15,15.37 33.53,15.75 v35.69,15.75 | LCD1.28 v42.41,15.5 v42.42,15.49
  Bottom 0.152: v42.42,15.49 35.94,15.49 v35.69,15.75
PMPD14  (via drill 0.3)
  Top 0.152: U1.83 29.8,17.31 30.23,16.89 30.99,16.89 v31.75,17.65 | LCD1.29 42.4,14.5 v42.42,14.48
  Bottom 0.152: v31.75,17.65 31.11,17.02 31.11,14.61 31.37,14.35 42.29,14.35 v42.42,14.48
PMPD15  (via drill 0.3)
  Top 0.152: U1.84 30.57,17.81 v30.73,17.65 | LCD1.30 42.38,13.5 v42.42,13.46
  Bottom 0.152: v30.73,17.65 30.73,14.48 31.75,13.46 v42.42,13.46
RC1  (via drill 0.3)
  Top 0.152: X3.1.5 v36.83,42.67 | U1.6 24.07,28.52 25.53,29.97 27.18,29.97 v27.43,30.23
  Bottom 0.152: v36.83,42.67 27.43,33.27 v27.43,30.23
RC2  (via drill 0.3)
  Top 0.152: U1.7 23.57,28.53 25.65,30.61 v26.16,30.61 | v36.83,43.69 X3.2.5
  Bottom 0.152: v26.16,30.61 26.16,33.02 v36.83,43.69
RC3  (via drill 0.3)
  Top 0.152: U1.8 23.07,28.54 24.26,29.72 v24.26,30.1 | X3.1.4 v34.29,42.67
  Bottom 0.152: v24.26,30.1 24.26,32.64 v34.29,42.67
RC4  (via drill 0.3)
  Top 0.152: U1.9 22.57,28.54 23.37,29.34 v23.37,30.1 | v34.29,43.69 X3.2.4
  Bottom 0.152: v23.37,30.1 23.37,32.77 v34.29,43.69
RS  (via drill 0.3)
  Top 0.152: v30.86,23.37 30.1,23.37 29.66,23.81 U1.96 | LCD1.8 42.36,35.5 v42.42,35.56
  Bottom 0.152: v30.86,23.37 31.11,23.62 31.11,27.94 38.73,35.56 v42.42,35.56
RX
  Top 0.152: U1.40 11.83,18.81 11.68,18.67 11.68,16.64 11.3,16.26 9.02,16.26 8.51,15.75 8.51,13.97 8.13,13.59 4.7,13.59 4.45,13.84 R11.2 R14.1
RX1/SDA3/MISO3  (via drill 0.3)
  Top 0.152: U1.52 15.07,10.76 v14.73,10.41 | v34.29,5.08 X4.1.4
  Bottom 0.152: v14.73,10.41 13.46,9.14 13.46,6.99 16.51,3.94 33.15,3.94 v34.29,5.08
SCLK  (via drill 0.3)
  Top 0.152: X1.5 14.63,42.19 v14.61,42.16 | U1.10 22.07,28.93 v22.48,29.34
  Bottom 0.152: v14.61,42.16 16,43.56 20.07,43.56 21.34,42.29 21.34,29.21 21.59,28.96 22.1,28.96 v22.48,29.34
TX
  Top 0.152: U1.39 11.56,19.31 11.3,19.05 11.3,16.89 11.05,16.64 8.89,16.64 7.87,15.62 R13.1
TX1/SCL3/MOSI3  (via drill 0.3)
  Top 0.152: U1.53 15.57,10.33 v14.73,9.53 | v31.75,5.08 X4.1.3
  Bottom 0.152: v14.73,9.53 13.84,8.64 13.84,7.11 16.64,4.32 30.99,4.32 v31.75,5.08
USBID/SCK3  (via drill 0.3)
  Top 0.152: v13.72,10.41 14.57,11.4 U1.51 14.57,14.26 14.02,14.81 U1.48 | v36.83,5.08 X4.1.5
  Bottom 0.152: v13.72,10.41 13.08,9.78 13.08,6.86 16.38,3.56 35.31,3.56 v36.83,5.08
VBUS  (via drill 0.3)
  Top 0.254: U1.54 16.07,9.96 v14.73,8.64 | C16.1 25.27,2.16 25.65,2.54 X4.1.1 26.67,4.19 v27.56,5.08
  Bottom 0.254: v14.73,8.64 14.73,6.86 16.89,4.7 27.18,4.7 v27.56,5.08
VDDCORE
  Top 0.254: U1.85 32.23,18.31 33.02,17.53 C1.2
VUSB  (via drill 0.3)
  Top 0.254: U1.55 16.57,9.46 v15.75,8.64 | X4.2.1 v26.67,5.46 25.65,4.45 C15.1
  Bottom 0.254: v15.75,8.64 15.75,6.6 17.14,5.21 26.42,5.21 v26.67,5.46
X+  (via drill 0.3)
  Top 0.152: U1.32 11.35,22.81 v11.22,22.94 | LCD1.12 v42.41,31.5 v42.42,31.5
  Bottom 0.152: v11.22,22.94 11.05,23.11 10.16,23.11 9.78,22.73 9.78,22.35 4.83,17.4 4.83,4.32 7.11,2.03 43.43,2.03 46.61,5.21 46.61,29.34 44.45,31.5 v42.42,31.5
X-  (via drill 0.3)
  Top 0.152: U1.34 10.64,21.81 v10.41,21.59 | LCD1.14 42.38,29.5 v42.42,29.46
  Bottom 0.152: v10.41,21.59 10.03,21.59 5.59,17.14 5.59,4.57 7.37,2.79 42.93,2.79 45.85,5.71 45.85,28.07 44.45,29.46 v42.42,29.46
Y+  (via drill 0.3)
  Top 0.152: U1.33 10.58,22.31 v10.41,22.48 | LCD1.13 42.4,30.5 v42.42,30.48
  Bottom 0.152: v10.41,22.48 5.21,17.27 5.21,4.45 7.24,2.41 43.18,2.41 46.23,5.46 46.23,28.7 44.45,30.48 v42.42,30.48
Y-  (via drill 0.3)
  Top 0.152: U1.35 11.53,21.31 v11.3,21.08 | R12.1 37.85,29.08 38.43,28.5 LCD1.15 42.37,28.5 v42.42,28.45
  Bottom 0.152: v11.3,21.08 11.18,20.95 9.91,20.95 5.97,17.02 5.97,4.7 7.49,3.17 42.67,3.17 45.47,5.97 45.47,27.43 44.45,28.45 v42.42,28.45